# Altium schematic sheet lononTV.SchDoc
size A2
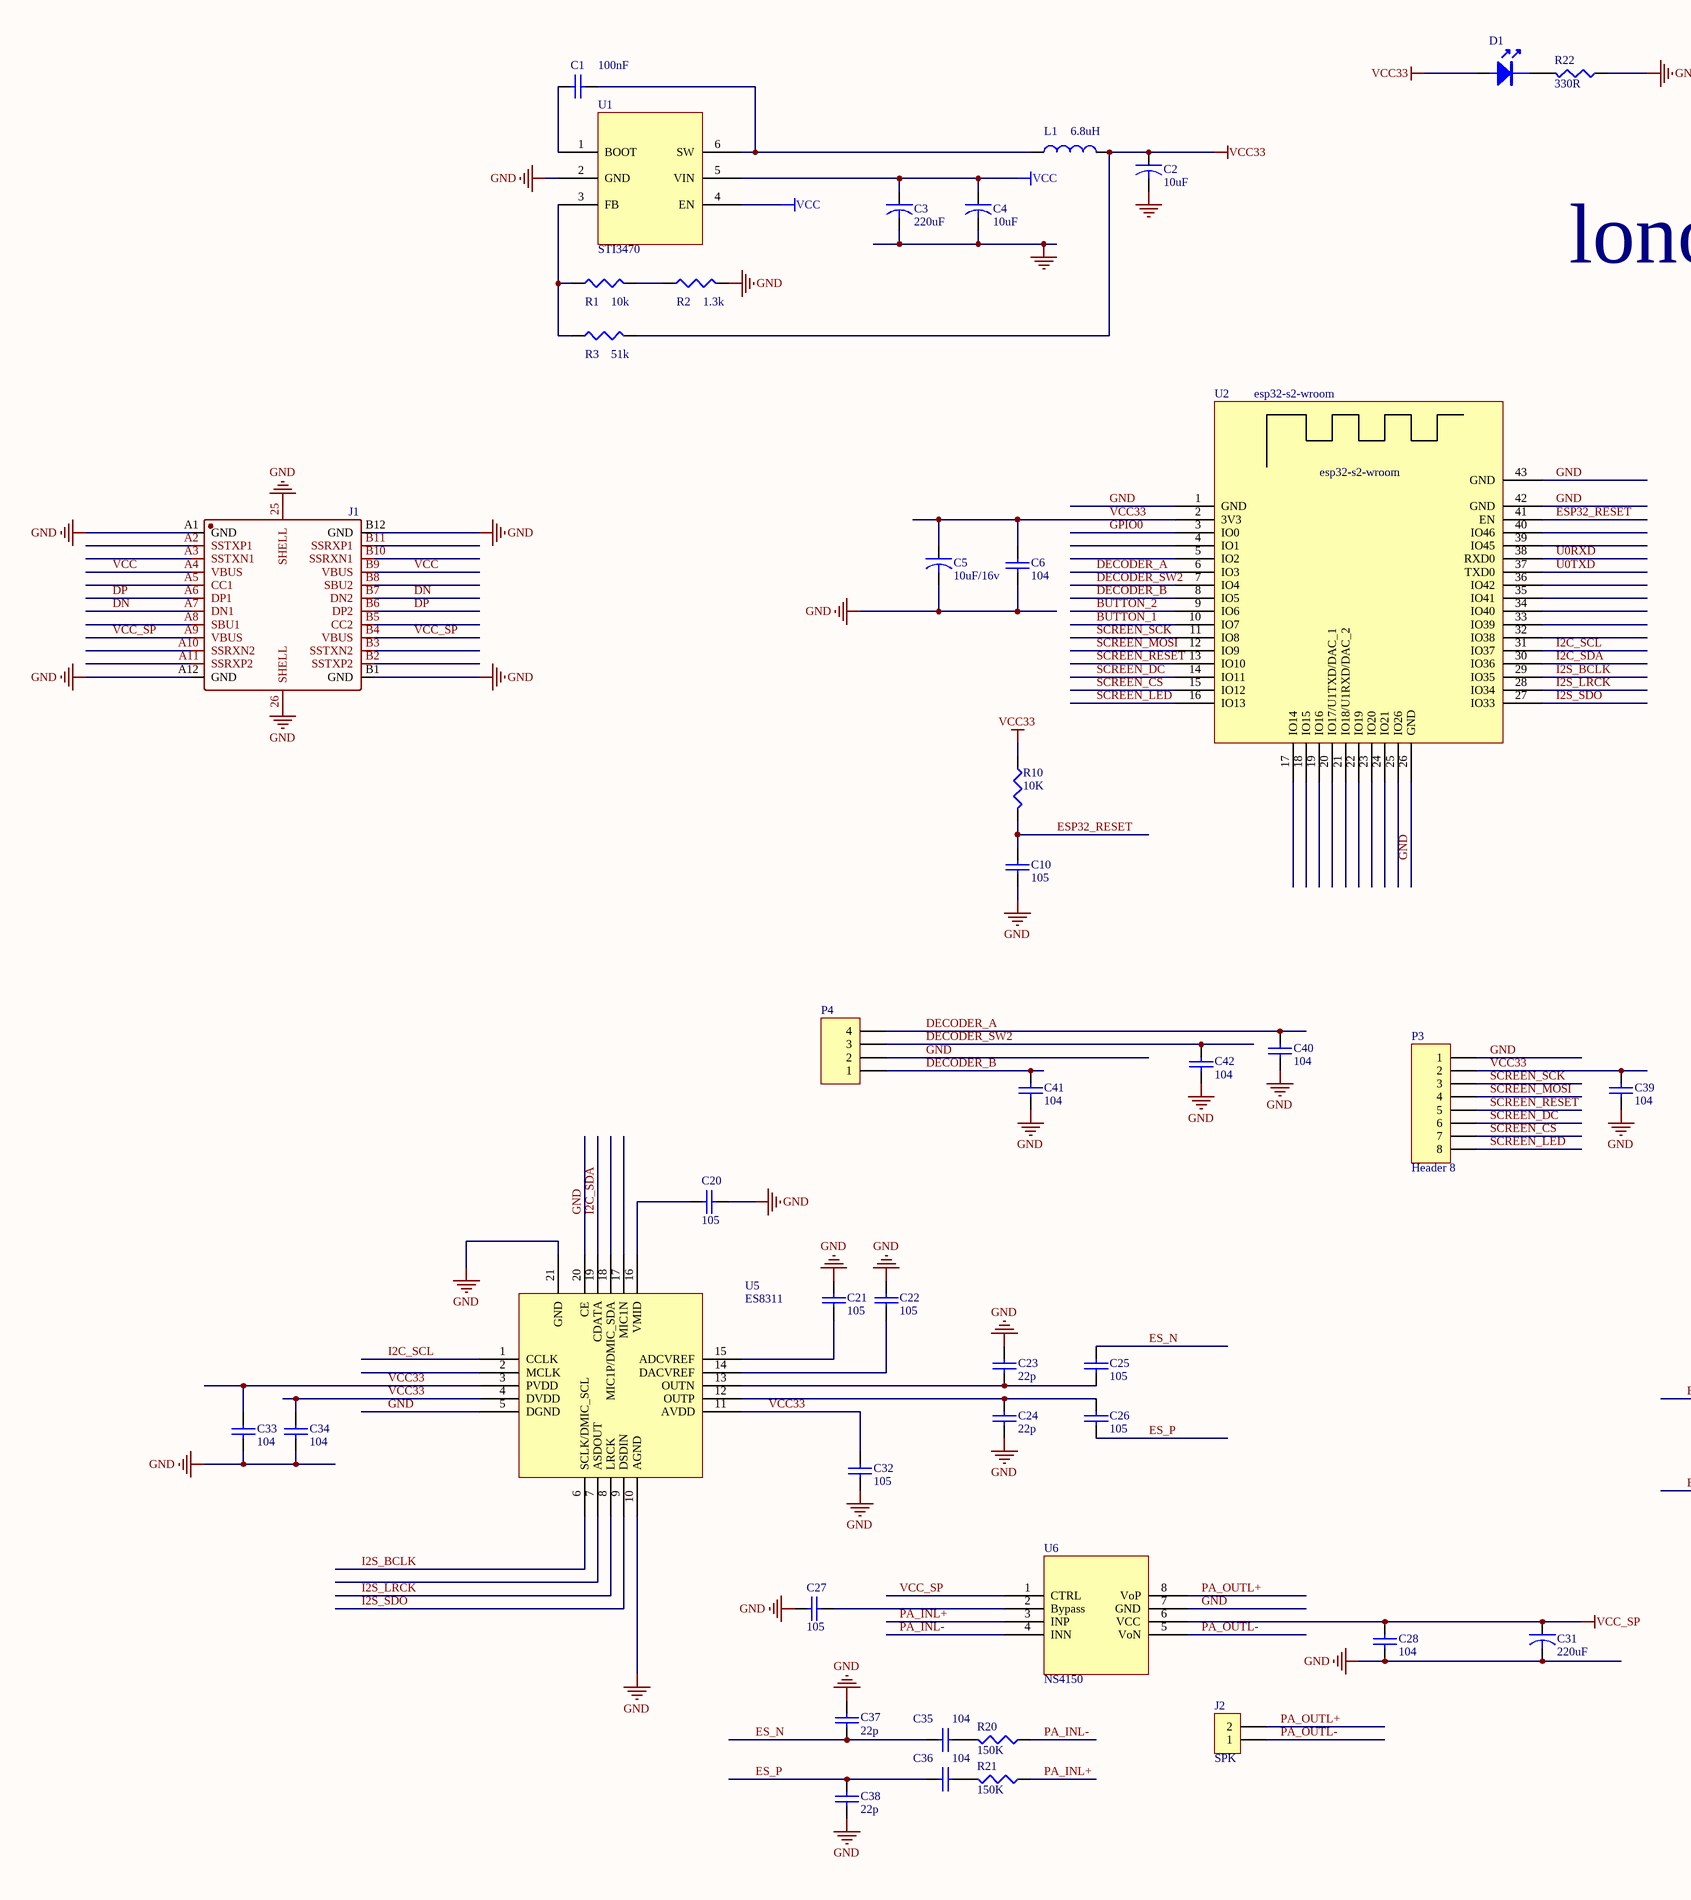
[diagram p0: lononTV.SchDoc, left]
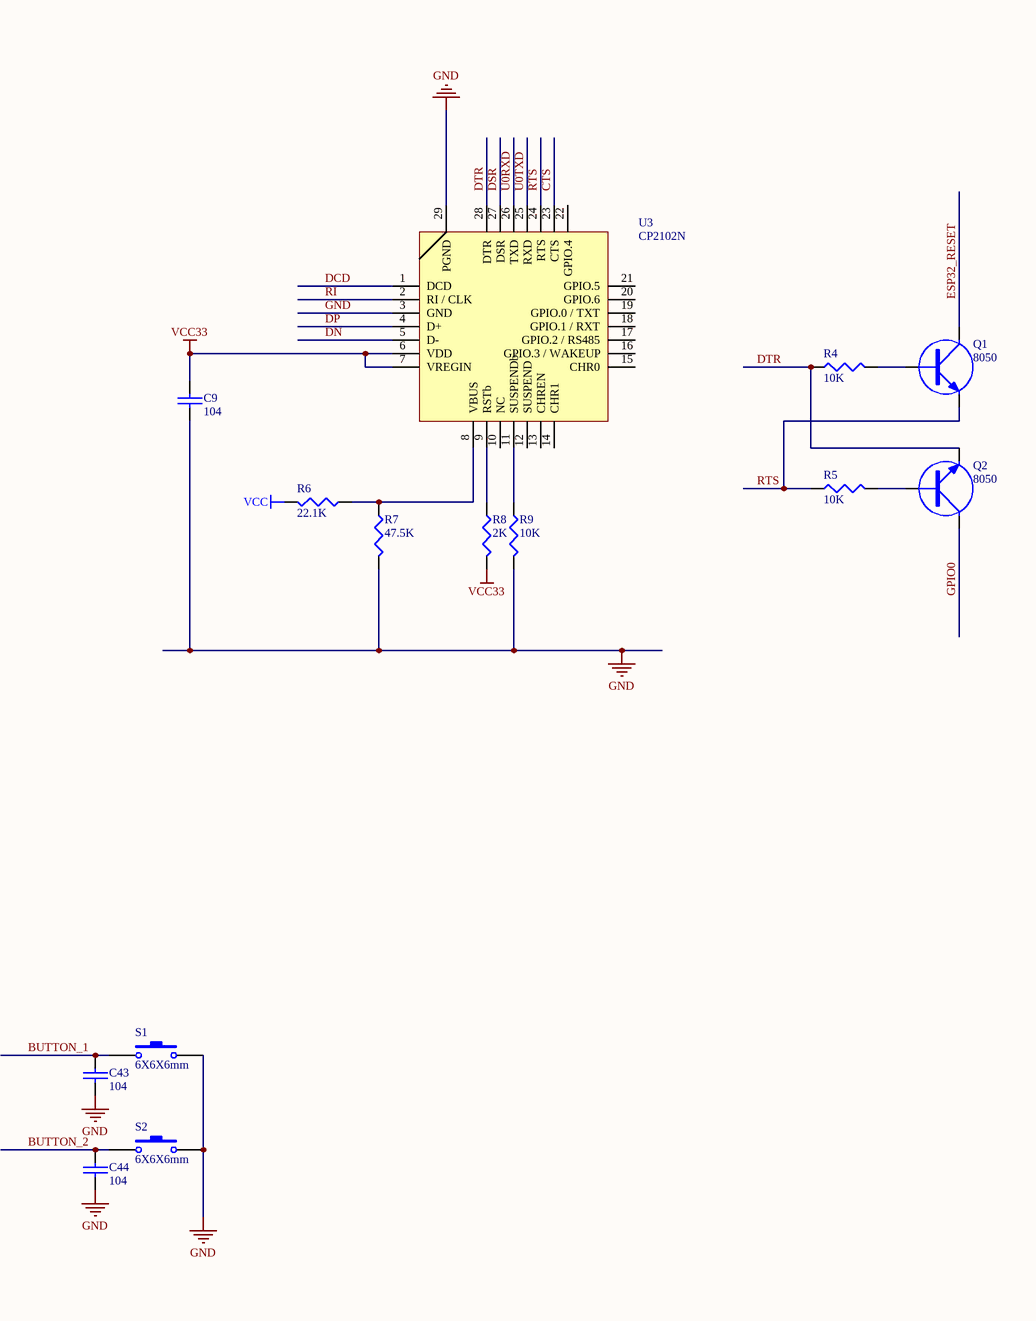
[diagram p1: lononTV.SchDoc, right]

## Parts
C1  100nF  [0603C]
C2  10uF  [1206-A]
C3  220uF  [铝电容6.6]
C4  10uF  [1206-A]
C5  10uF/16v  [1206-A]
C6  104  [C0603 - duplicate]
C9  104  [C0603 - duplicate]
C10  105  [C0603 - duplicate]
C20  105  [C0603 - duplicate]
C21  105  [C0603 - duplicate]
C22  105  [C0603 - duplicate]
C23  22p  [C0603 - duplicate]
C24  22p  [C0603 - duplicate]
C25  105  [C0603 - duplicate]
C26  105  [C0603 - duplicate]
C27  105  [C0603 - duplicate]
C28  104  [C0603 - duplicate]
C31  220uF  [铝电容6.6]
C32  105  [C0603 - duplicate]
C33  104  [C0603 - duplicate]
C34  104  [C0603 - duplicate]
C35  104  [C0603 - duplicate]
C36  104  [C0603 - duplicate]
C37  22p  [C0603 - duplicate]
C38  22p  [C0603 - duplicate]
C39  104  [C0603 - duplicate]
C40  104  [C0603 - duplicate]
C41  104  [C0603 - duplicate]
C42  104  [C0603 - duplicate]
C43  104  [C0603 - duplicate]
C44  104  [C0603 - duplicate]
D1  (no value)  [d0805]
J1  (no value)  [TYPE-C夹板C2856664]
J2  SPK  [MX1.25-2P 立]
L1  6.8uH  [电感7.4*6.6]
P3  Header 8  [HDR1X8]
P4  Header 4  [MX1.25-4P 卧]  (value not drawn)
Q1  8050  [3904]
Q2  8050  [3904]
R1  10k  [0603R]
R2  1.3k  [0603R]
R3  51k  [0603R]
R4  10K  [R0603]
R5  10K  [R0603]
R6  22.1K  [R0603]
R7  47.5K  [R0603]
R8  2K  [R0603]
R9  10K  [R0603]
R10  10K  [0603R]
R20  150K  [0603R]
R21  150K  [0603R]
R22  330R  [0603R]
S1  6X6X6mm  [C400237_KT红轴]
S2  6X6X6mm  [C400237_KT红轴]
U1  STI3470  [SOT-23-6L]
U2  esp32-s2-wroom  [ESP32-S2-WROOM]
U3  CP2102N  [QFN 28-pin-05P]
U5  ES8311  [QFN20_3*3]
U6  NS4150  [MSOP8]

## Nets
GND: C2.2 C3.2 C4.2 C5.2 C6.2 C9.2 C10.2 C20.2 C21.2 C22.2 C23.1 C24.2 C27.1 C28.1 C31.2 C32.1 C33.1 C34.1 C37.1 C38.2 C39.2 C40.2 C41.2 C42.2 C43.2 C44.2 J1.25(SHELL) J1.26(SHELL) J1.A1(GND) J1.A12(GND) J1.B1(GND) J1.B12(GND) P3.1 P4.2 R2.1 R7.2 R9.2 R22.1 S1.2 S2.2 U1.2(GND) U2.1(GND) U2.26(GND) U2.42(GND) U2.43(GND) U3.3(GND) U3.29(PGND) U5.5(DGND) U5.10(AGND) U5.20(CE) U5.21(GND) U6.7(GND)
VCC: C3.1 C4.1 J1.A4(VBUS) J1.B9(VBUS) R6.2 U1.4(EN) U1.5(VIN)
VCC33: C2.1 C5.1 C6.1 C9.1 C32.2 C33.2 C34.2 C39.1 D1.A L1.2 P3.2 R3.1 R8.2 R10.1 U2.2(3V3) U3.6(VDD) U3.7(VREGIN) U5.3(PVDD) U5.4(DVDD) U5.11(AVDD)
VCC_SP: C28.2 C31.1 J1.A9(VBUS) J1.B4(VBUS) U6.1(CTRL) U6.6(VCC)
BUTTON_1: C43.1 S1.1 U2.10(IO7)
BUTTON_2: C44.1 S2.1 U2.9(IO6)
CTS: U3.23(CTS)
DCD: U3.1(DCD)
DECODER_A: C40.1 P4.4 U2.6(IO3)
DECODER_B: C41.1 P4.1 U2.8(IO5)
DECODER_SW2: C42.1 P4.3 U2.7(IO4)
DN: J1.A7(DN1) J1.B7(DN2) U3.5(D-)
DP: J1.A6(DP1) J1.B6(DP2) U3.4(D+)
DSR: U3.27(DSR)
DTR: Q2.3(E) R4.1 U3.28(DTR)
ES_N: C25.1 C35.2 C37.2
ES_P: C26.2 C36.2 C38.1
ESP32_RESET: C10.1 Q1.2(C) R10.2 U2.41(EN)
GPIO0: Q2.2(C) U2.3(IO0)
I2C_SCL: U2.31(IO37) U5.1(CCLK)
I2C_SDA: U2.30(IO36) U5.19(CDATA)
I2S_BCLK: U2.29(IO35) U5.6(SCLK/DMIC_SCL)
I2S_LRCK: U2.28(IO34) U5.8(LRCK)
I2S_SDO: U2.27(IO33) U5.9(DSDIN)
PA_INL+: R21.1 U6.3(INP)
PA_INL-: R20.1 U6.4(INN)
PA_OUTL+: J2.2 U6.8(VoP)
PA_OUTL-: J2.1 U6.5(VoN)
RI: U3.2(RI_/_CLK)
RTS: Q1.3(E) R5.1 U3.24(RTS)
SCREEN_CS: P3.7 U2.15(IO12)
SCREEN_DC: P3.6 U2.14(IO11)
SCREEN_LED: P3.8 U2.16(IO13)
SCREEN_MOSI: P3.4 U2.12(IO9)
SCREEN_RESET: P3.5 U2.13(IO10)
SCREEN_SCK: P3.3 U2.11(IO8)
U0RXD: U2.38(RXD0) U3.26(TXD)
U0TXD: U2.37(TXD0) U3.25(RXD)
NetC1_1: C1.1 U1.1(BOOT)
NetC1_2: C1.2 L1.1 U1.6(SW)
NetC20_1: C20.1 U5.16(VMID)
NetC21_1: C21.1 U5.15(ADCVREF)
NetC22_1: C22.1 U5.14(DACVREF)
NetC23_2: C23.2 C25.2 U5.13(OUTN)
NetC24_1: C24.1 C26.1 U5.12(OUTP)
NetC27_2: C27.2 U6.2(Bypass)
NetC35_1: C35.1 R20.2
NetC36_1: C36.1 R21.2
NetD1_K: D1.K R22.2
NetQ1_1: Q1.1(B) R4.2
NetQ2_1: Q2.1(B) R5.2
NetR1_1: R1.1 R2.2
NetR1_2: R1.2 R3.2 U1.3(FB)
NetR6_1: R6.1 R7.1 U3.8(VBUS)
NetR8_1: R8.1 U3.9(RSTb)
NetR9_1: R9.1 U3.11(SUSPENDb)

Not connected (* = marked no-connect by the designer): J1 A2(SSTXP1) A3(SSTXN1) A5(CC1) A8(SBU1) A10(SSRXN2) A11(SSRXP2) B2(SSTXP2) B3(SSTXN2) B5(CC2) B8(SBU2) B10(SSRXN1) B11(SSRXP1); U2 4(IO1) 5(IO2) 17(IO14) 18(IO15) 19(IO16) 20(IO17/U1TXD/DAC_1) 21(IO18/U1RXD/DAC_2) 22(IO19) 23(IO20) 24(IO21) 25(IO26) 32(IO38) 33(IO39) 34(IO40) 35(IO41) 36(IO42) 39(IO45) 40(IO46); U3 10(NC) 12(SUSPEND) 13(CHREN) 14(CHR1) 15(CHR0) 16(GPIO.3_/_WAKEUP) 17(GPIO.2_/_RS485) 18(GPIO.1_/_RXT) 19(GPIO.0_/_TXT) 20(GPIO.6) 21(GPIO.5) 22(GPIO.4); U5 2(MCLK) 7(ASDOUT) 17(MIC1N) 18(MIC1P/DMIC_SDA)

## Notes on the sheet
- lononTV v1.5

## Library data of the parts
C1 = CAP: 贴片电容
C2-C4 = CAPACITOR: 钽电容
C5 C31 = CAPACITOR
C6 C9 C10 C20-C28 C32-C44 = CAP: Capacitor
D1 = LED
J1 = TYPE-C夹板C2856664
J2 = CON2
L1 = Inductor: Manufacturer: Generic Components; Class: Passive; Value: 10mH; Published: 08/06/2000; Publisher: Altium Hobart Technology Centre; SubClass: Inductor
P3 = Header 8: Header, 8-Pin; LatestRevisionDate: 17-Jul-2002; LatestRevisionNote: Re-released for DXP Platform.; Publisher: Altium Limited
P4 = Header 4: Header, 4-Pin; LatestRevisionDate: 17-Jul-2002; LatestRevisionNote: Re-released for DXP Platform.; Publisher: Altium Limited
Q1 Q2 = NPN: NPN Transistor
R1-R10 R20-R22 = RES1
S1 S2 = SW-PB: Switch; Published: 24-Mar-1999; LatestRevisionDate: 17-Jul-2002; LatestRevisionNote: Re-released for DXP Platform.; PackageReference: SPST-2; Publisher: Altium Limited
U1 = RT7285/A